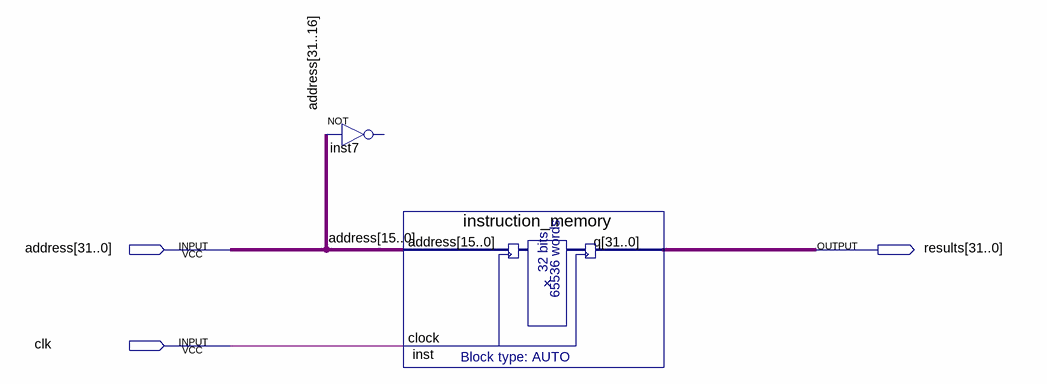
[diagram p0: schematic sheet]
// Quartus schematic inst_memory.bdf as structural Verilog: 2 symbols, 3 pins
module inst_memory (
  input  [31:0] address,
  input  clk,
  output [31:0] results
);

  // NOT inst7 has open pins: IN=address[31:16], OUT=open
  instruction_memory inst (.address(address[15:0]), .clock(clk), .q(results));
endmodule
